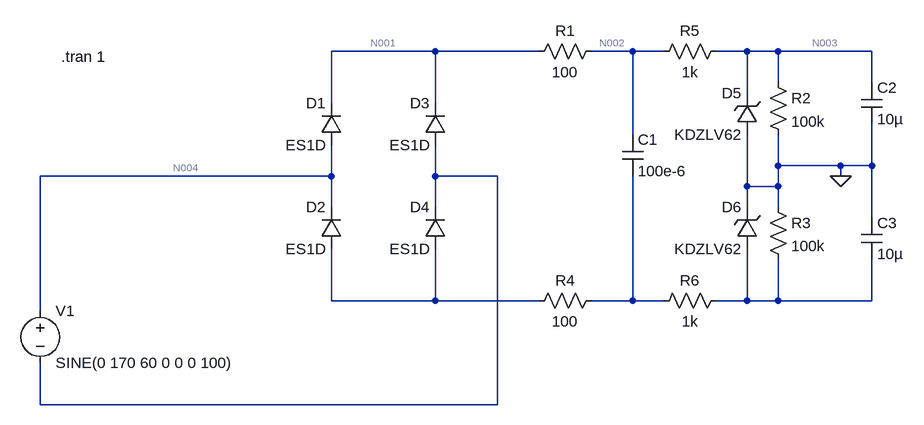
[diagram p0: schematic Draft1.asc]
Draft1.asc, the LTspice schematic file:
Version 4
SHEET 1 1464 680
WIRE 624 -256 464 -256
WIRE 784 -256 624 -256
WIRE 928 -256 864 -256
WIRE 976 -256 928 -256
WIRE 1104 -256 1056 -256
WIRE 1152 -256 1104 -256
WIRE 1296 -256 1152 -256
WIRE 1152 -208 1152 -256
WIRE 1296 -208 1296 -256
WIRE 1104 -192 1104 -256
WIRE 464 -176 464 -256
WIRE 624 -176 624 -256
WIRE 928 -128 928 -256
WIRE 1152 -80 1152 -128
WIRE 1248 -80 1152 -80
WIRE 1296 -80 1296 -144
WIRE 1296 -80 1248 -80
WIRE 464 -64 464 -112
WIRE 464 -64 16 -64
WIRE 624 -64 624 -112
WIRE 720 -64 624 -64
WIRE 1248 -64 1248 -80
WIRE 1104 -48 1104 -128
WIRE 1152 -48 1152 -80
WIRE 1152 -48 1104 -48
WIRE 464 -16 464 -64
WIRE 624 -16 624 -64
WIRE 1104 -16 1104 -48
WIRE 1152 -16 1152 -48
WIRE 1296 0 1296 -80
WIRE 464 128 464 48
WIRE 624 128 624 48
WIRE 624 128 464 128
WIRE 784 128 624 128
WIRE 928 128 928 -64
WIRE 928 128 864 128
WIRE 976 128 928 128
WIRE 1104 128 1104 48
WIRE 1104 128 1056 128
WIRE 1152 128 1152 64
WIRE 1152 128 1104 128
WIRE 1296 128 1296 64
WIRE 1296 128 1152 128
WIRE 16 144 16 -64
WIRE 16 288 16 224
WIRE 720 288 720 -64
WIRE 720 288 16 288
FLAG 1248 -64 0
SYMBOL voltage 16 128 R0
WINDOW 123 0 0 Left 0
WINDOW 39 0 0 Left 0
SYMATTR InstName V1
SYMATTR Value SINE(0 170 60 0 0 0 100)
SYMBOL diode 480 -112 R180
WINDOW 0 24 64 Left 2
WINDOW 3 24 0 Left 2
SYMATTR InstName D1
SYMATTR Value ES1D
SYMBOL diode 480 48 R180
WINDOW 0 24 64 Left 2
WINDOW 3 24 0 Left 2
SYMATTR InstName D2
SYMATTR Value ES1D
SYMBOL diode 640 -112 R180
WINDOW 0 24 64 Left 2
WINDOW 3 24 0 Left 2
SYMATTR InstName D3
SYMATTR Value ES1D
SYMBOL diode 640 48 R180
WINDOW 0 24 64 Left 2
WINDOW 3 24 0 Left 2
SYMATTR InstName D4
SYMATTR Value ES1D
SYMBOL res 880 -272 R90
WINDOW 0 0 56 VBottom 2
WINDOW 3 32 56 VTop 2
SYMATTR InstName R1
SYMATTR Value 100
SYMBOL cap 912 -128 R0
SYMATTR InstName C1
SYMATTR Value 100e-6
SYMBOL res 1136 -224 R0
SYMATTR InstName R2
SYMATTR Value 100k
SYMBOL res 1136 -32 R0
SYMATTR InstName R3
SYMATTR Value 100k
SYMBOL res 880 112 R90
WINDOW 0 0 56 VBottom 2
WINDOW 3 32 56 VTop 2
SYMATTR InstName R4
SYMATTR Value 100
SYMBOL zener 1120 -128 R180
WINDOW 0 24 64 Left 2
WINDOW 3 24 0 Left 2
SYMATTR InstName D5
SYMATTR Value KDZLV62
SYMATTR Description Diode
SYMATTR Type diode
SYMBOL zener 1120 48 R180
WINDOW 0 24 64 Left 2
WINDOW 3 24 0 Left 2
SYMATTR InstName D6
SYMATTR Value KDZLV62
SYMATTR Description Diode
SYMATTR Type diode
SYMBOL cap 1280 -208 R0
SYMATTR InstName C2
SYMATTR Value 10µ
SYMBOL cap 1280 0 R0
SYMATTR InstName C3
SYMATTR Value 10µ
SYMBOL res 1072 -272 R90
WINDOW 0 0 56 VBottom 2
WINDOW 3 32 56 VTop 2
SYMATTR InstName R5
SYMATTR Value 1k
SYMBOL res 1072 112 R90
WINDOW 0 0 56 VBottom 2
WINDOW 3 32 56 VTop 2
SYMATTR InstName R6
SYMATTR Value 1k
TEXT 48 -248 Left 2 !.tran 1

The netlist it stands for:
* Draft1.asc
V1 N004 N005 SINE(0 170 60 0 0 0 100)
D1 N004 N001 ES1D
D2 N006 N004 ES1D
D3 N005 N001 ES1D
D4 N006 N005 ES1D
R1 N002 N001 100
C1 N002 N007 100e-6
R2 N003 0 100k
R3 0 N008 100k
R4 N007 N006 100
D5 0 N003 KDZLV62
D6 N008 0 KDZLV62
C2 N003 0 10µ
C3 0 N008 10µ
R5 N003 N002 1k
R6 N008 N007 1k
.model D D
.lib standard.dio
.tran 1
.backanno
.end

* Results of the author's LTspice run, read from the files saved beside the schematic
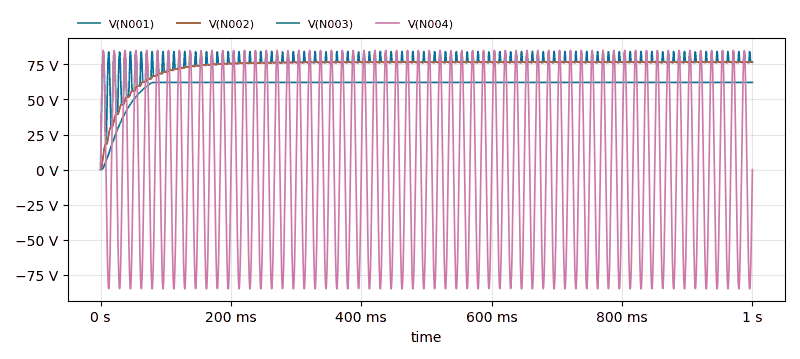
[diagram p1: Transient Analysis of Draft1.asc, plotted from the saved traces]
* Transient Analysis, 1 run:
*   V(N001): min 0 V, max 84.3 V, average 76.34 V, rms 76.65 V, last 76.51 V
*   V(N002): min 0 V, max 76.74 V, average 73.52 V, rms 74.17 V, last 76.51 V
*   V(N003): min 0 V, max 62.15 V, average 60.17 V, rms 60.79 V, last 62.15 V
*   V(N004): min -85 V, max 85 V, average -1.827 mV, rms 60.45 V, last 23.59 µV